# Altium project HIL_project.PrjPcb
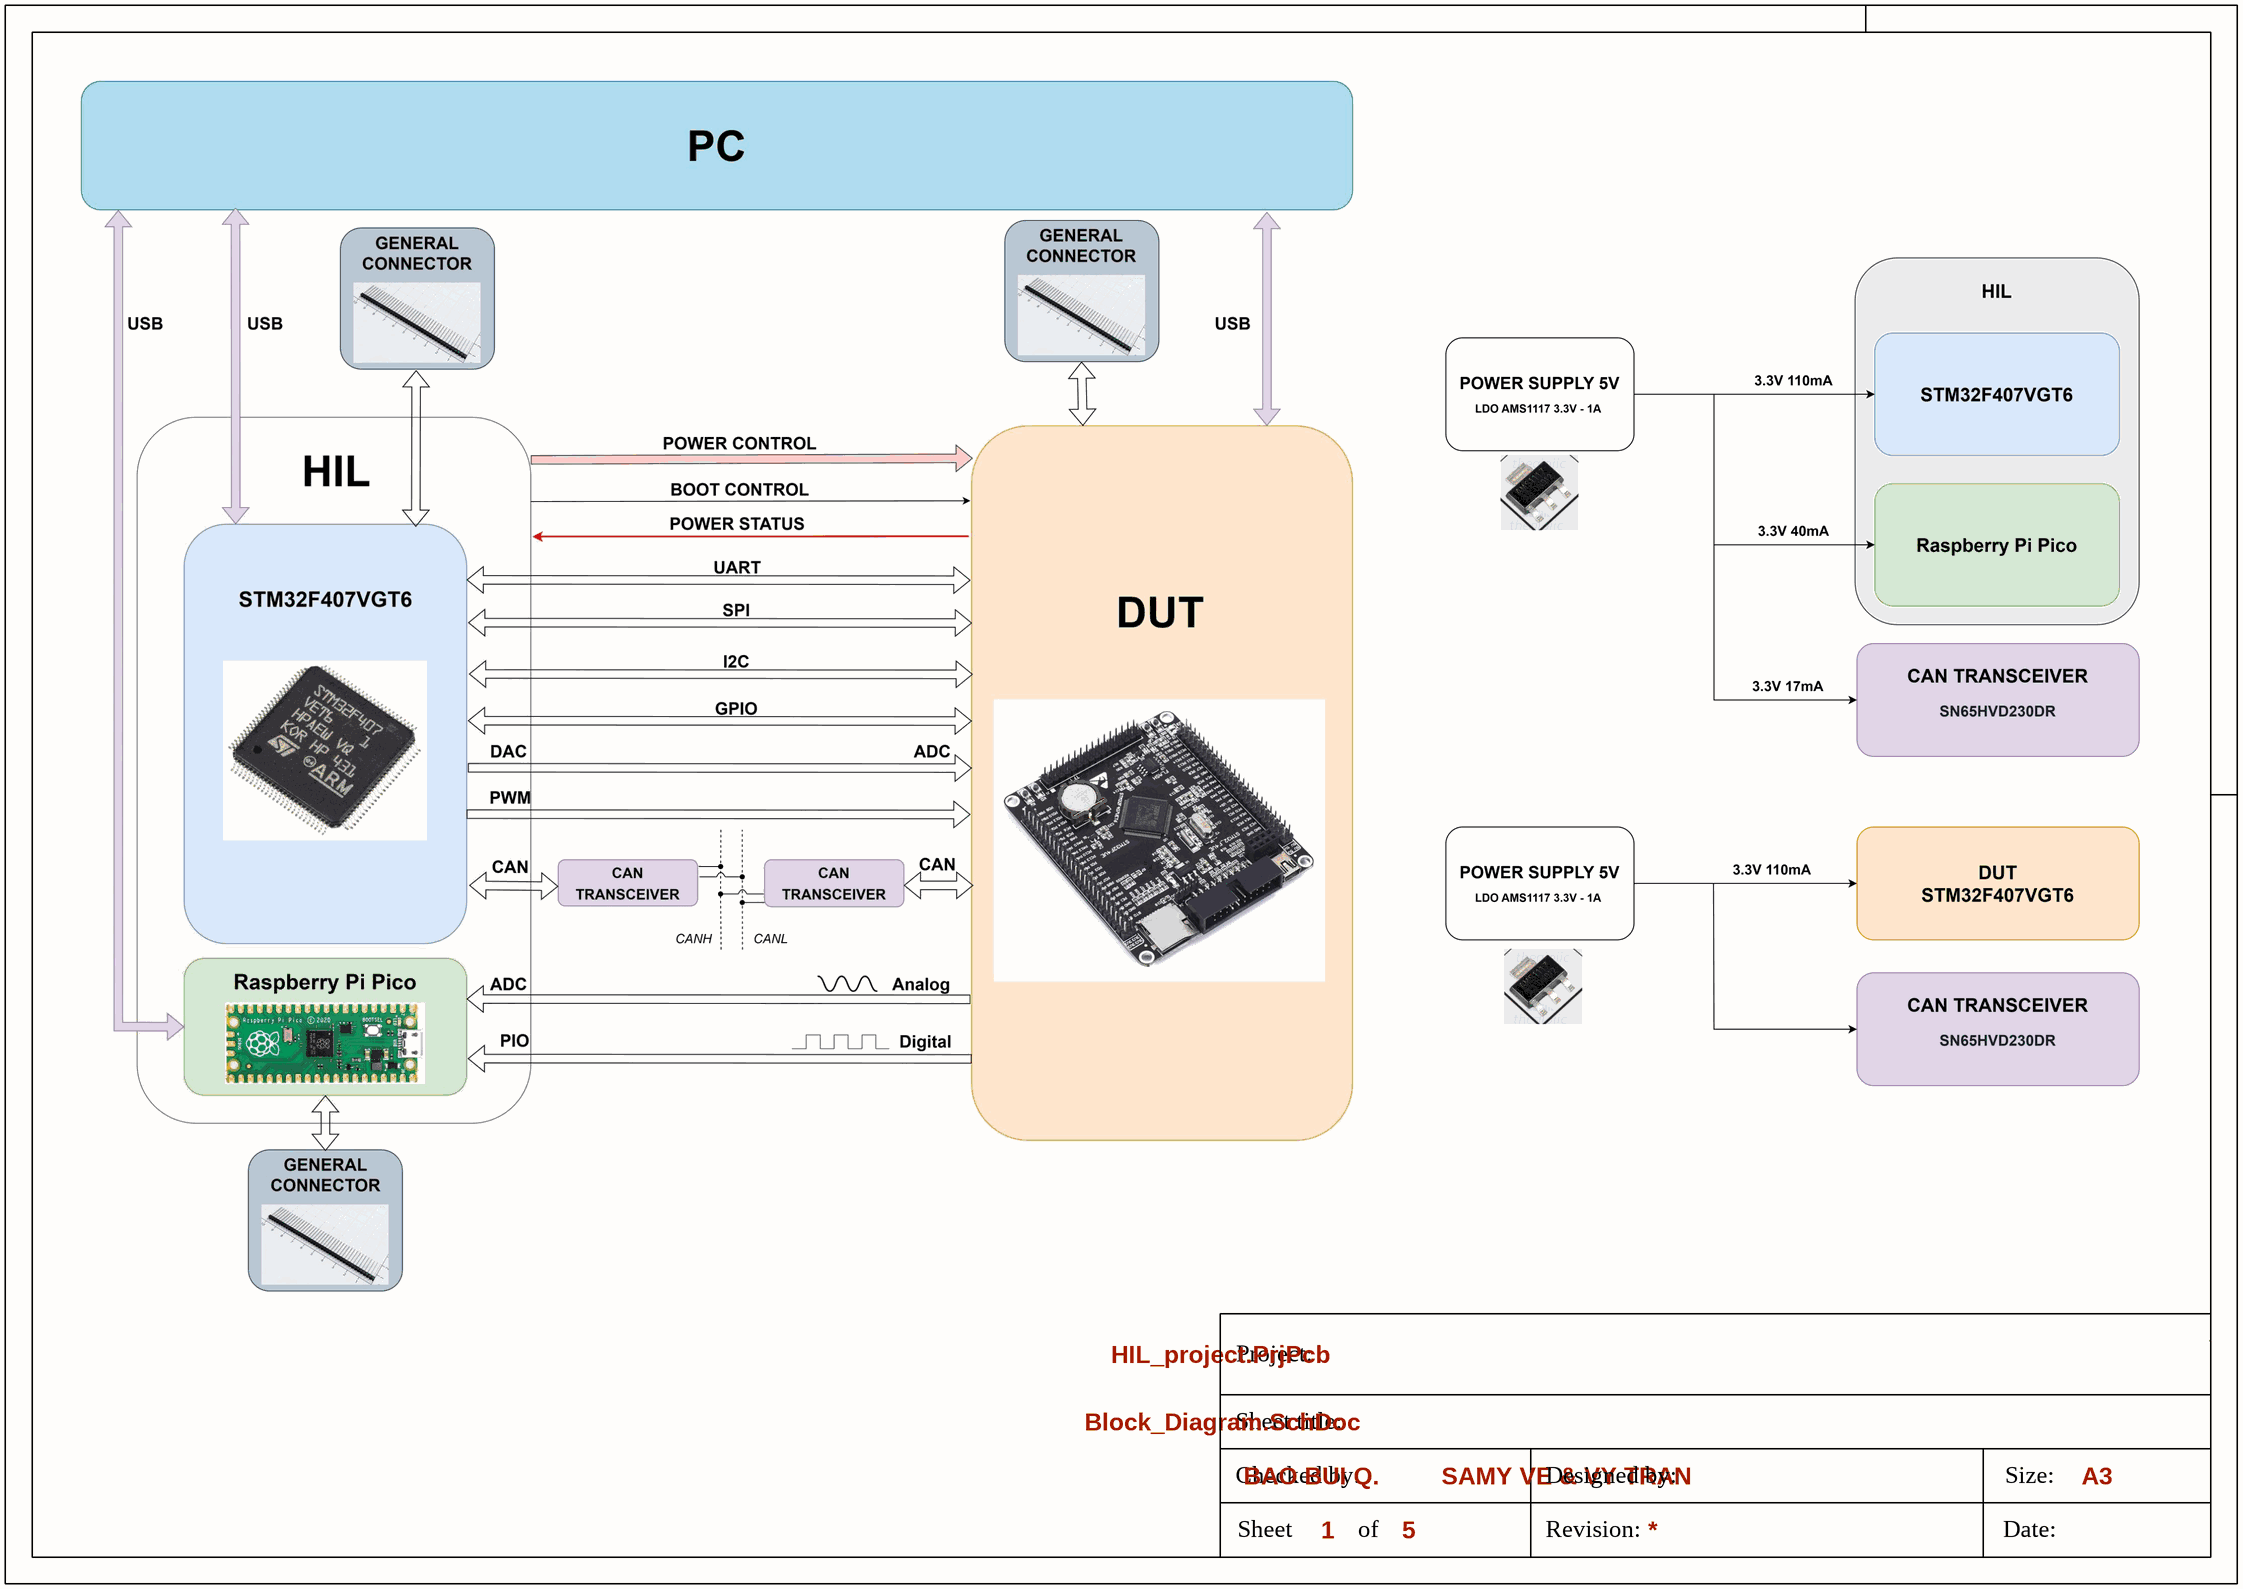
[diagram p0: Block_Diagram.SchDoc]
5 sheets, 116 parts. Net scope: global (net labels, ports and power ports of the same name join across sheets).
Board file: HIL_project.PcbDoc
Sheets:
  Block_Diagram.SchDoc
  HIL.SchDoc
  Power.SchDoc
  DUT.SchDoc
  HIL_Header.SchDoc

## Sheet Block_Diagram.SchDoc
size 420 x 297 mm; Designed_by: SAMY VE & VY TRAN; DrawnBy: SAMY VE & VY TRAN; SheetNumber: 1; SheetTotal: 5

### Notes on the sheet
- Project:
- Sheet title:
- BAO BUI Q.
- SAMY VE & VY TRAN
- A3
- Sheet
- Checked by:
- of
- Revision:
- Designed by:
- Size:
- Date:

## Sheet HIL.SchDoc
size 420 x 297 mm; DrawnBy: SAMY VE & VY TRAN; SheetNumber: 2; SheetTotal: 5
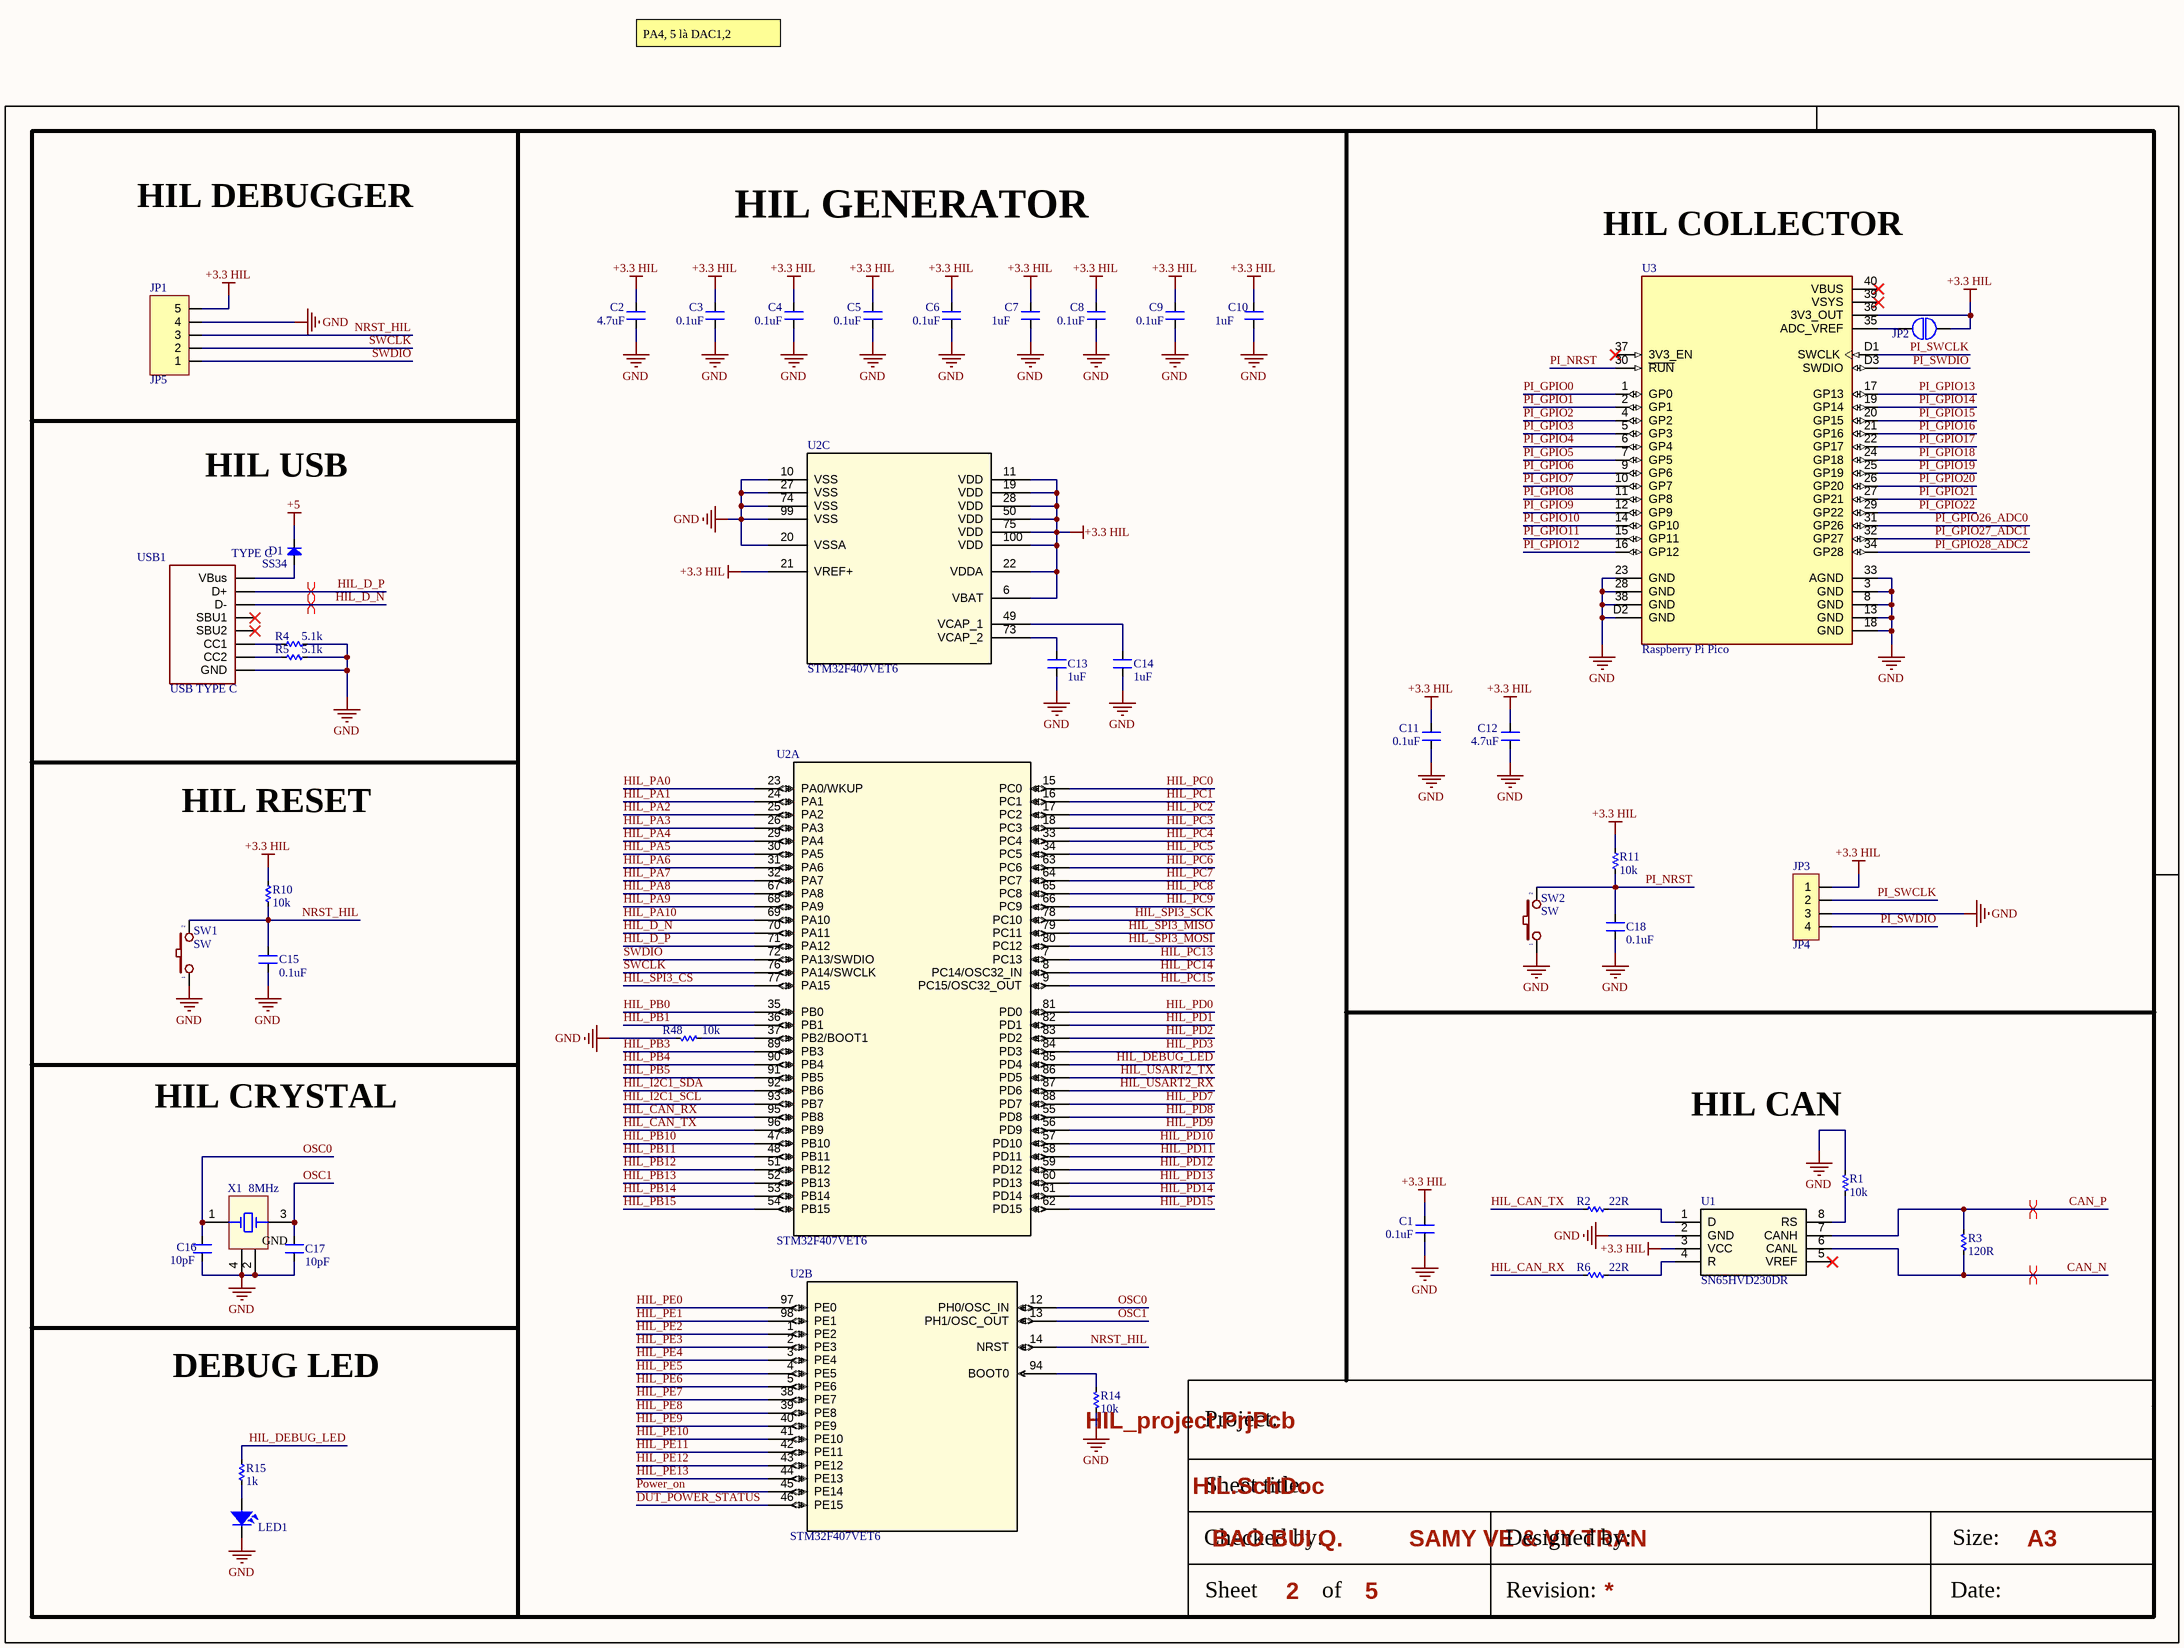
[diagram p1: HIL.SchDoc]

### Parts
C1  0.1uF  [CN-SMD-0603]
C2  4.7uF  [CN-SMD-0603]
C3  0.1uF  [CN-SMD-0603]
C4  0.1uF  [CN-SMD-0603]
C5  0.1uF  [CN-SMD-0603]
C6  0.1uF  [CN-SMD-0603]
C7  1uF  [CN-SMD-0603]
C8  0.1uF  [CN-SMD-0603]
C9  0.1uF  [CN-SMD-0603]
C10  1uF  [CN-SMD-0603]
C11  0.1uF  [CN-SMD-0603]
C12  4.7uF  [CN-SMD-0603]
C13  1uF  [CN-SMD-0603]
C14  1uF  [CN-SMD-0603]
C15  0.1uF  [CN-SMD-0603]
C16  10pF  [CN-SMD-0603]
C17  10pF  [CN-SMD-0603]
C18  0.1uF  [CN-SMD-0603]
D1  SS34  [DIO-SMD-A]
JP1  JP5  [JP5-D1C]
JP2  JUMP2  [Jump2]  (value not drawn)
JP3  JP4  [JP4-D1T]
LED1  LED  [LED-0805-Red]  (value not drawn)
R1  10k  [RES-SMD-0603]
R2  22R  [RES-SMD-0603]
R3  120R  [RES-SMD-0603]
R4  5.1k  [RES-SMD-0603]
R5  5.1k  [RES-SMD-0603]
R6  22R  [RES-SMD-0603]
R10  10k  [RES-SMD-0603]
R11  10k  [RES-SMD-0603]
R14  10k  [RES-SMD-0603]
R15  1k  [RES-SMD-0603]
R48  10k  [RES-SMD-0603]
SW1  SW  [SW1-SMD]
SW2  SW  [SW1-SMD]
U1  SN65HVD230DR  [SO8]
U2  STM32F407VET6  [LQFP100]  (parts A,B,C of 3)
U3  Raspberry Pi Pico  [Raspberry Pi Pico]
USB1  USB TYPE C  [TYPE C 16P]
X1  8MHz  [XT4-16.000MHz-4_V]

### Nets
+3.3 HIL: C1.1 C2.1 C3.1 C4.1 C5.1 C6.1 C7.1 C8.1 C9.1 C10.1 C11.1 C12.1 JP1.5 JP2.2 JP3.1 R10.1 R11.1 U1.3(VCC) U2.6(VBAT) U2.11(VDD) U2.19(VDD) U2.21(VREF+) U2.22(VDDA) U2.28(VDD) U2.50(VDD) U2.75(VDD) U2.100(VDD) U3.36(3V3_OUT)
+5: D1.2(K)
GND: C1.2 C2.2 C3.2 C4.2 C5.2 C6.2 C7.2 C8.2 C9.2 C10.2 C11.2 C12.2 C13.1 C14.1 C15.1 C16.1 C17.2 C18.1 JP1.4 JP3.3 LED1.2 R1.1 R4.2 R5.2 R14.2 R48.1 SW1.1 SW2.1 U1.2(GND) U2.10(VSS) U2.20(VSSA) U2.27(VSS) U2.74(VSS) U2.99(VSS) U3.3(GND) U3.8(GND) U3.13(GND) U3.18(GND) U3.23(GND) U3.28(GND) U3.33(AGND) U3.38(GND) U3.D2(GND) USB1.A1,A12,B1,B12,SHIELD(GND) X1.2(GND) X1.4(GND)
CAN_N: R3.2 U1.6(CANL)
CAN_P: R3.1 U1.7(CANH)
DUT_POWER_STATUS: U2.46(PE15)
HIL_CAN_RX: R6.2 U2.95(PB8)
HIL_CAN_TX: R2.2 U2.96(PB9)
HIL_D_N: U2.70(PA11) USB1.A7,B7(D-)
HIL_D_P: U2.71(PA12) USB1.A6,B6(D+)
HIL_DEBUG_LED: R15.2 U2.85(PD4)
HIL_I2C1_SCL: U2.93(PB7)
HIL_I2C1_SDA: U2.92(PB6)
HIL_PA0: U2.23(PA0/WKUP)
HIL_PA1: U2.24(PA1)
HIL_PA2: U2.25(PA2)
HIL_PA3: U2.26(PA3)
HIL_PA4: U2.29(PA4)
HIL_PA5: U2.30(PA5)
HIL_PA6: U2.31(PA6)
HIL_PA7: U2.32(PA7)
HIL_PA8: U2.67(PA8)
HIL_PA9: U2.68(PA9)
HIL_PA10: U2.69(PA10)
HIL_PB0: U2.35(PB0)
HIL_PB1: U2.36(PB1)
HIL_PB3: U2.89(PB3)
HIL_PB4: U2.90(PB4)
HIL_PB5: U2.91(PB5)
HIL_PB10: U2.47(PB10)
HIL_PB11: U2.48(PB11)
HIL_PB12: U2.51(PB12)
HIL_PB13: U2.52(PB13)
HIL_PB14: U2.53(PB14)
HIL_PB15: U2.54(PB15)
HIL_PC0: U2.15(PC0)
HIL_PC1: U2.16(PC1)
HIL_PC2: U2.17(PC2)
HIL_PC3: U2.18(PC3)
HIL_PC4: U2.33(PC4)
HIL_PC5: U2.34(PC5)
HIL_PC6: U2.63(PC6)
HIL_PC7: U2.64(PC7)
HIL_PC8: U2.65(PC8)
HIL_PC9: U2.66(PC9)
HIL_PC13: U2.7(PC13)
HIL_PC14: U2.8(PC14/OSC32_IN)
HIL_PC15: U2.9(PC15/OSC32_OUT)
HIL_PD0: U2.81(PD0)
HIL_PD1: U2.82(PD1)
HIL_PD2: U2.83(PD2)
HIL_PD3: U2.84(PD3)
HIL_PD7: U2.88(PD7)
HIL_PD8: U2.55(PD8)
HIL_PD9: U2.56(PD9)
HIL_PD10: U2.57(PD10)
HIL_PD11: U2.58(PD11)
HIL_PD12: U2.59(PD12)
HIL_PD13: U2.60(PD13)
HIL_PD14: U2.61(PD14)
HIL_PD15: U2.62(PD15)
HIL_PE0: U2.97(PE0)
HIL_PE1: U2.98(PE1)
HIL_PE2: U2.1(PE2)
HIL_PE3: U2.2(PE3)
HIL_PE4: U2.3(PE4)
HIL_PE5: U2.4(PE5)
HIL_PE6: U2.5(PE6)
HIL_PE7: U2.38(PE7)
HIL_PE8: U2.39(PE8)
HIL_PE9: U2.40(PE9)
HIL_PE10: U2.41(PE10)
HIL_PE11: U2.42(PE11)
HIL_PE12: U2.43(PE12)
HIL_PE13: U2.44(PE13)
HIL_SPI3_CS: U2.77(PA15)
HIL_SPI3_MISO: U2.79(PC11)
HIL_SPI3_MOSI: U2.80(PC12)
HIL_SPI3_SCK: U2.78(PC10)
HIL_USART2_RX: U2.87(PD6)
HIL_USART2_TX: U2.86(PD5)
NRST_HIL: C15.2 JP1.3 R10.2 SW1.2 U2.14(NRST)
OSC0: C16.2 U2.12(PH0/OSC_IN) X1.1(XTAL)
OSC1: C17.1 U2.13(PH1/OSC_OUT) X1.3(XTAL)
PI_GPIO0: U3.1(GP0)
PI_GPIO1: U3.2(GP1)
PI_GPIO2: U3.4(GP2)
PI_GPIO3: U3.5(GP3)
PI_GPIO4: U3.6(GP4)
PI_GPIO5: U3.7(GP5)
PI_GPIO6: U3.9(GP6)
PI_GPIO7: U3.10(GP7)
PI_GPIO8: U3.11(GP8)
PI_GPIO9: U3.12(GP9)
PI_GPIO10: U3.14(GP10)
PI_GPIO11: U3.15(GP11)
PI_GPIO12: U3.16(GP12)
PI_GPIO13: U3.17(GP13)
PI_GPIO14: U3.19(GP14)
PI_GPIO15: U3.20(GP15)
PI_GPIO16: U3.21(GP16)
PI_GPIO17: U3.22(GP17)
PI_GPIO18: U3.24(GP18)
PI_GPIO19: U3.25(GP19)
PI_GPIO20: U3.26(GP20)
PI_GPIO21: U3.27(GP21)
PI_GPIO22: U3.29(GP22)
PI_GPIO26_ADC0: U3.31(GP26)
PI_GPIO27_ADC1: U3.32(GP27)
PI_GPIO28_ADC2: U3.34(GP28)
PI_NRST: C18.2 R11.2 SW2.2 U3.30(~{RUN})
PI_SWCLK: JP3.2 U3.D1(SWCLK)
PI_SWDIO: JP3.4 U3.D3(SWDIO)
Power_on: U2.45(PE14)
SWCLK: JP1.2 U2.76(PA14/SWCLK)
SWDIO: JP1.1 U2.72(PA13/SWDIO)
NetC13_2: C13.2 U2.73(VCAP_2)
NetC14_2: C14.2 U2.49(VCAP_1)
NetD1_1: D1.1(A) USB1.A4,A9,B4,B9(VBus)
NetJP2_1: JP2.1 U3.35(ADC_VREF)
NetLED1_1: LED1.1 R15.1
NetR1_2: R1.2 U1.8(RS)
NetR2_1: R2.1 U1.1(D)
NetR4_1: R4.1 USB1.A5(CC1)
NetR5_1: R5.1 USB1.B5(CC2)
NetR6_1: R6.1 U1.4(R)
NetR14_1: R14.1 U2.94(BOOT0)
NetR48_2: R48.2 U2.37(PB2/BOOT1)

Not connected (* = marked no-connect by the designer): U1 5(VREF)*; U3 37(3V3_EN)* 39(VSYS)* 40(VBUS)*; USB1 A8(SBU1)* B8(SBU2)*

### Layout directives
differential pair: CAN_N, CAN_P, HIL_D_N, HIL_D_P

### Notes on the sheet
- PA4, 5 là DAC1,2
- HIL DEBUGGER
- HIL GENERATOR
- (near U3) HIL COLLECTOR
- HIL USB
- HIL RESET
- HIL CRYSTAL
- HIL CAN
- DEBUG LED
- Project:
- Sheet title:
- BAO BUI Q.
- SAMY VE & VY TRAN
- A3
- Sheet
- Checked by:
- of
- Revision:
- Designed by:
- Size:
- Date:
- (in symbol USB TYPE C) TYPE C

### Library data of the parts
C1-C18 = CN: Value: 33pF
D1 = Diode SMD: Default Diode; Code - JEDEC: DO-214-AB; Value: 1N5007; Published: 8-Jun-2000; Revision: July-2002: Re-released for DXP Platform.; Publisher: Altium Limited
JP1 = JP5: WR-PHD 2.54 mm Angled Socket Header; Manufacturer: W¨¹rth Elektronik eiSos GmbH; partNo: 613005143121; ComponentLink1 Description: Manufacturer; ComponentLink2 Description: Datasheet; NoPins: 05; Created Date: 29 March 2013; ComponentLink1URL: http://www.we-online.com; ComponentLink2URL: http://katalog.we-online.de/em/datasheet/6130xx143121.pdf; Created by: Karrer Zheng
JP3 = JP4: WR-PHD 2.54 mm Angled Socket Header; Manufacturer: W¨¹rth Elektronik eiSos GmbH; partNo: 613004143121; ComponentLink1 Description: Manufacturer; ComponentLink2 Description: Datasheet; NoPins: 04; Created Date: 29 March 2013; ComponentLink1URL: http://www.we-online.com; ComponentLink2URL: http://katalog.we-online.de/em/datasheet/6130xx143121.pdf; Created by: Karrer Zheng
LED1 = LED SMD: Value: LED 3 - 5 ly 2 Colour
R1-R6 R10 R11 R14 R15 R48 = Res-SMD: Resistor; Manufacturer: Generic Components; Class: Passive; Published: 08/06/2000; Publisher: Altium Hobart Technology Centre
SW1 SW2 = SW2: Switch button 2 pin; Value: SW chip 2 pin
U1 = SN65HVD251DR: IC TRANSCEIVER HALF 1/1 8SOIC
U2 = STM32F407VET6: High-performance foundation line, ARM Cortex-M4 core with DSP and FPU, 1 Mbyte Flash, 168 MHz CPU, ART Accelerator; Mfr_Name: STMicroelectronics; RefDes: RefDes; Type: Type
X1 = XT4: Crystal, 16 MHz, -30 to 85 degC, 3.2 x 2.5 x 0.9 mm SMD; Value: 4Mhz

## Sheet Power.SchDoc
size 420 x 297 mm; SheetNumber: 3; SheetTotal: 5
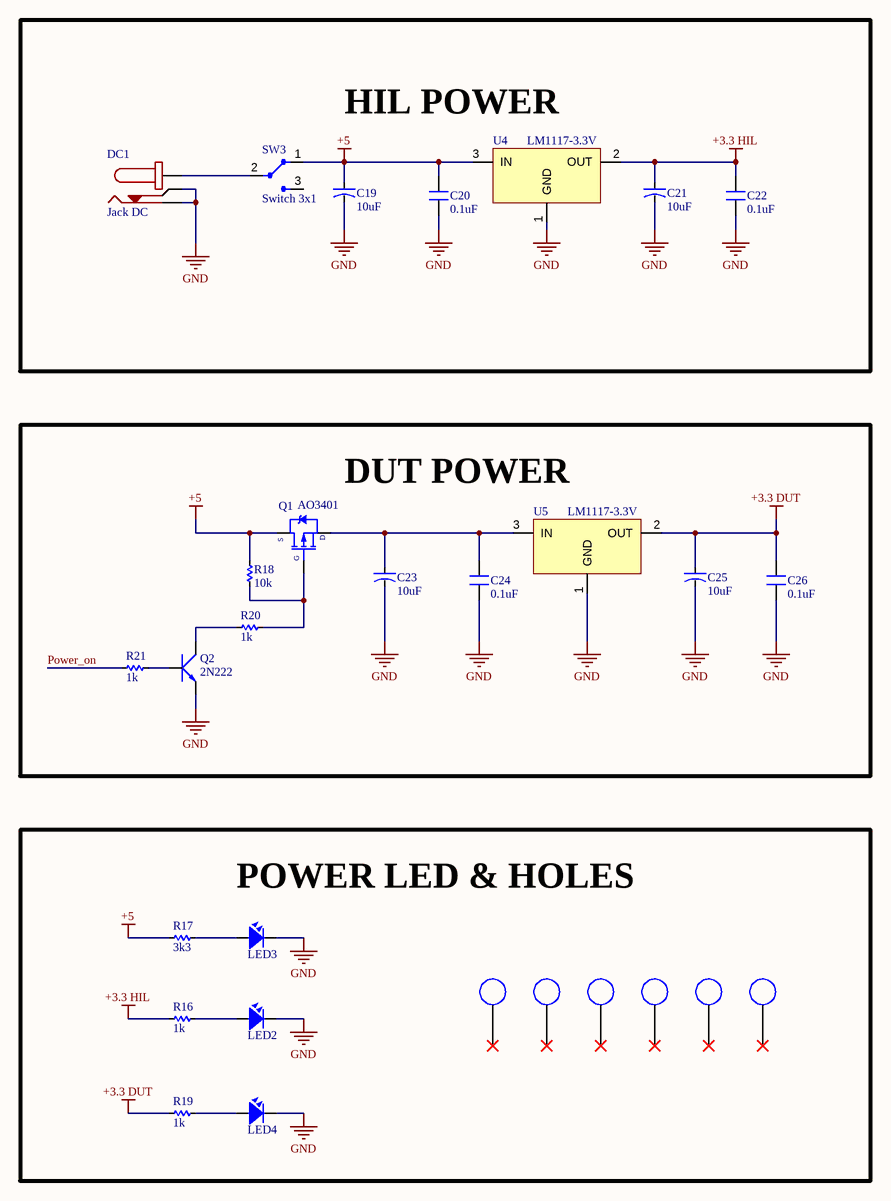
[diagram p2: Power.SchDoc]

### Parts
C19  10uF  [CAP-ALU-SMD-4.5x5x1.4]
C20  0.1uF  [CN-SMD-0603]
C21  10uF  [CAP-ALU-SMD-4.5x5x1.4]
C22  0.1uF  [CN-SMD-0603]
C23  10uF  [CAP-ALU-SMD-4.5x5x1.4]
C24  0.1uF  [CN-SMD-0603]
C25  10uF  [CAP-ALU-SMD-4.5x5x1.4]
C26  0.1uF  [CN-SMD-0603]
DC1  Jack DC  [DC0]
H1  M3  [M3]  (value not drawn)
H2  M3  [M3]  (value not drawn)
H3  M3  [M3]  (value not drawn)
H4  M3  [M3]  (value not drawn)
H5  M3  [M3]  (value not drawn)
H6  M3  [M3]  (value not drawn)
LED2  LED  [LED-0805-Red]  (value not drawn)
LED3  LED  [LED-0805-Red]  (value not drawn)
LED4  LED  [LED-0805-Red]  (value not drawn)
Q1  AO3401  [SOT23-123]
Q2  2N222  [SOT23-231]
R16  1k  [RES-SMD-0603]
R17  3k3  [RES-SMD-0603]
R18  10k  [RES-SMD-0603]
R19  1k  [RES-SMD-0603]
R20  1k  [RES-SMD-0603]
R21  1k  [RES-SMD-0603]
SW3  Switch 3x1  [SS12D00]
U4  LM1117-3.3V  [SOT223]
U5  LM1117-3.3V  [SOT223]

### Blocks framed on the sheet
HIL POWER: C19-C22 DC1 SW3 U4
DUT POWER: C23-C26 Q1 Q2 R18 R20 R21 U5
POWER LED & HOLES: H1-H6 LED2-LED4 R16 R17 R19

### Nets
+3.3 DUT: C25.1 C26.2 R19.1 U5.2(OUT)
+3.3 HIL: C21.1 C22.2 R16.1 U4.2(OUT)
+5: C19.1 C20.2 Q1.3(S) R17.1 R18.2 SW3.1 U4.3(IN)
GND: C19.2 C20.1 C21.2 C22.1 C23.2 C24.1 C25.2 C26.1 DC1.2(TN) DC1.3(T) LED2.2 LED3.2 LED4.2 Q2.1(E) U4.1(GND) U5.1(GND)
Power_on: R21.2
NetC23_1: C23.1 C24.2 Q1.2(D) U5.3(IN)
NetDC1_1: DC1.1(S) SW3.2
NetLED2_1: LED2.1 R16.2
NetLED3_1: LED3.1 R17.2
NetLED4_1: LED4.1 R19.2
NetQ1_1: Q1.1(G) R18.1 R20.1
NetQ2_2: Q2.2(B) R21.1
NetQ2_3: Q2.3(C) R20.2

Not connected (* = marked no-connect by the designer): H1 1(76)*; H2 1(76)*; H3 1(76)*; H4 1(76)*; H5 1(76)*; H6 1(76)*; SW3 3(I/O2)

### Notes on the sheet
- Project:
- Sheet title:
- BAO BUI Q.
- SAMY VE & VY TRAN
- A3
- Sheet
- Checked by:
- of
- Revision:
- Designed by:
- Size:
- Date:

### Library data of the parts
C19 C21 C23 C25 = CN-ALU-DIP: Capacitor (Semiconductor SIM Model); Value: 104; LatestRevisionDate: 17-Jul-2002; LatestRevisionNote: Re-released for DXP Platform.; PackageReference: C1206; Publisher: Altium Limited
C20 C22 C24 C26 = CN: Value: 33pF
DC1 = DCIN: Jack DC input; Value: Jac DC
LED2-LED4 = LED SMD: Value: LED 3 - 5 ly 2 Colour
Q1 = AO3401: P-MOS 30V 4A
Q2 = 2N222: NPN 600mW, ECB; Value: C1815
R16-R21 = Res-SMD: as R1 on sheet HIL; Published: 08/06/2000; Publisher: Altium Hobart Technology Centre
SW3 = SW3x1: Value: Switch 4x2
U4 U5 = LM1117: 800mA Low-Dropout Linear Regulator; Creator: Nguyen Ba Bien; Website: http://group3i.net

## Sheet DUT.SchDoc
size 420 x 297 mm; SheetNumber: 4; SheetTotal: 5
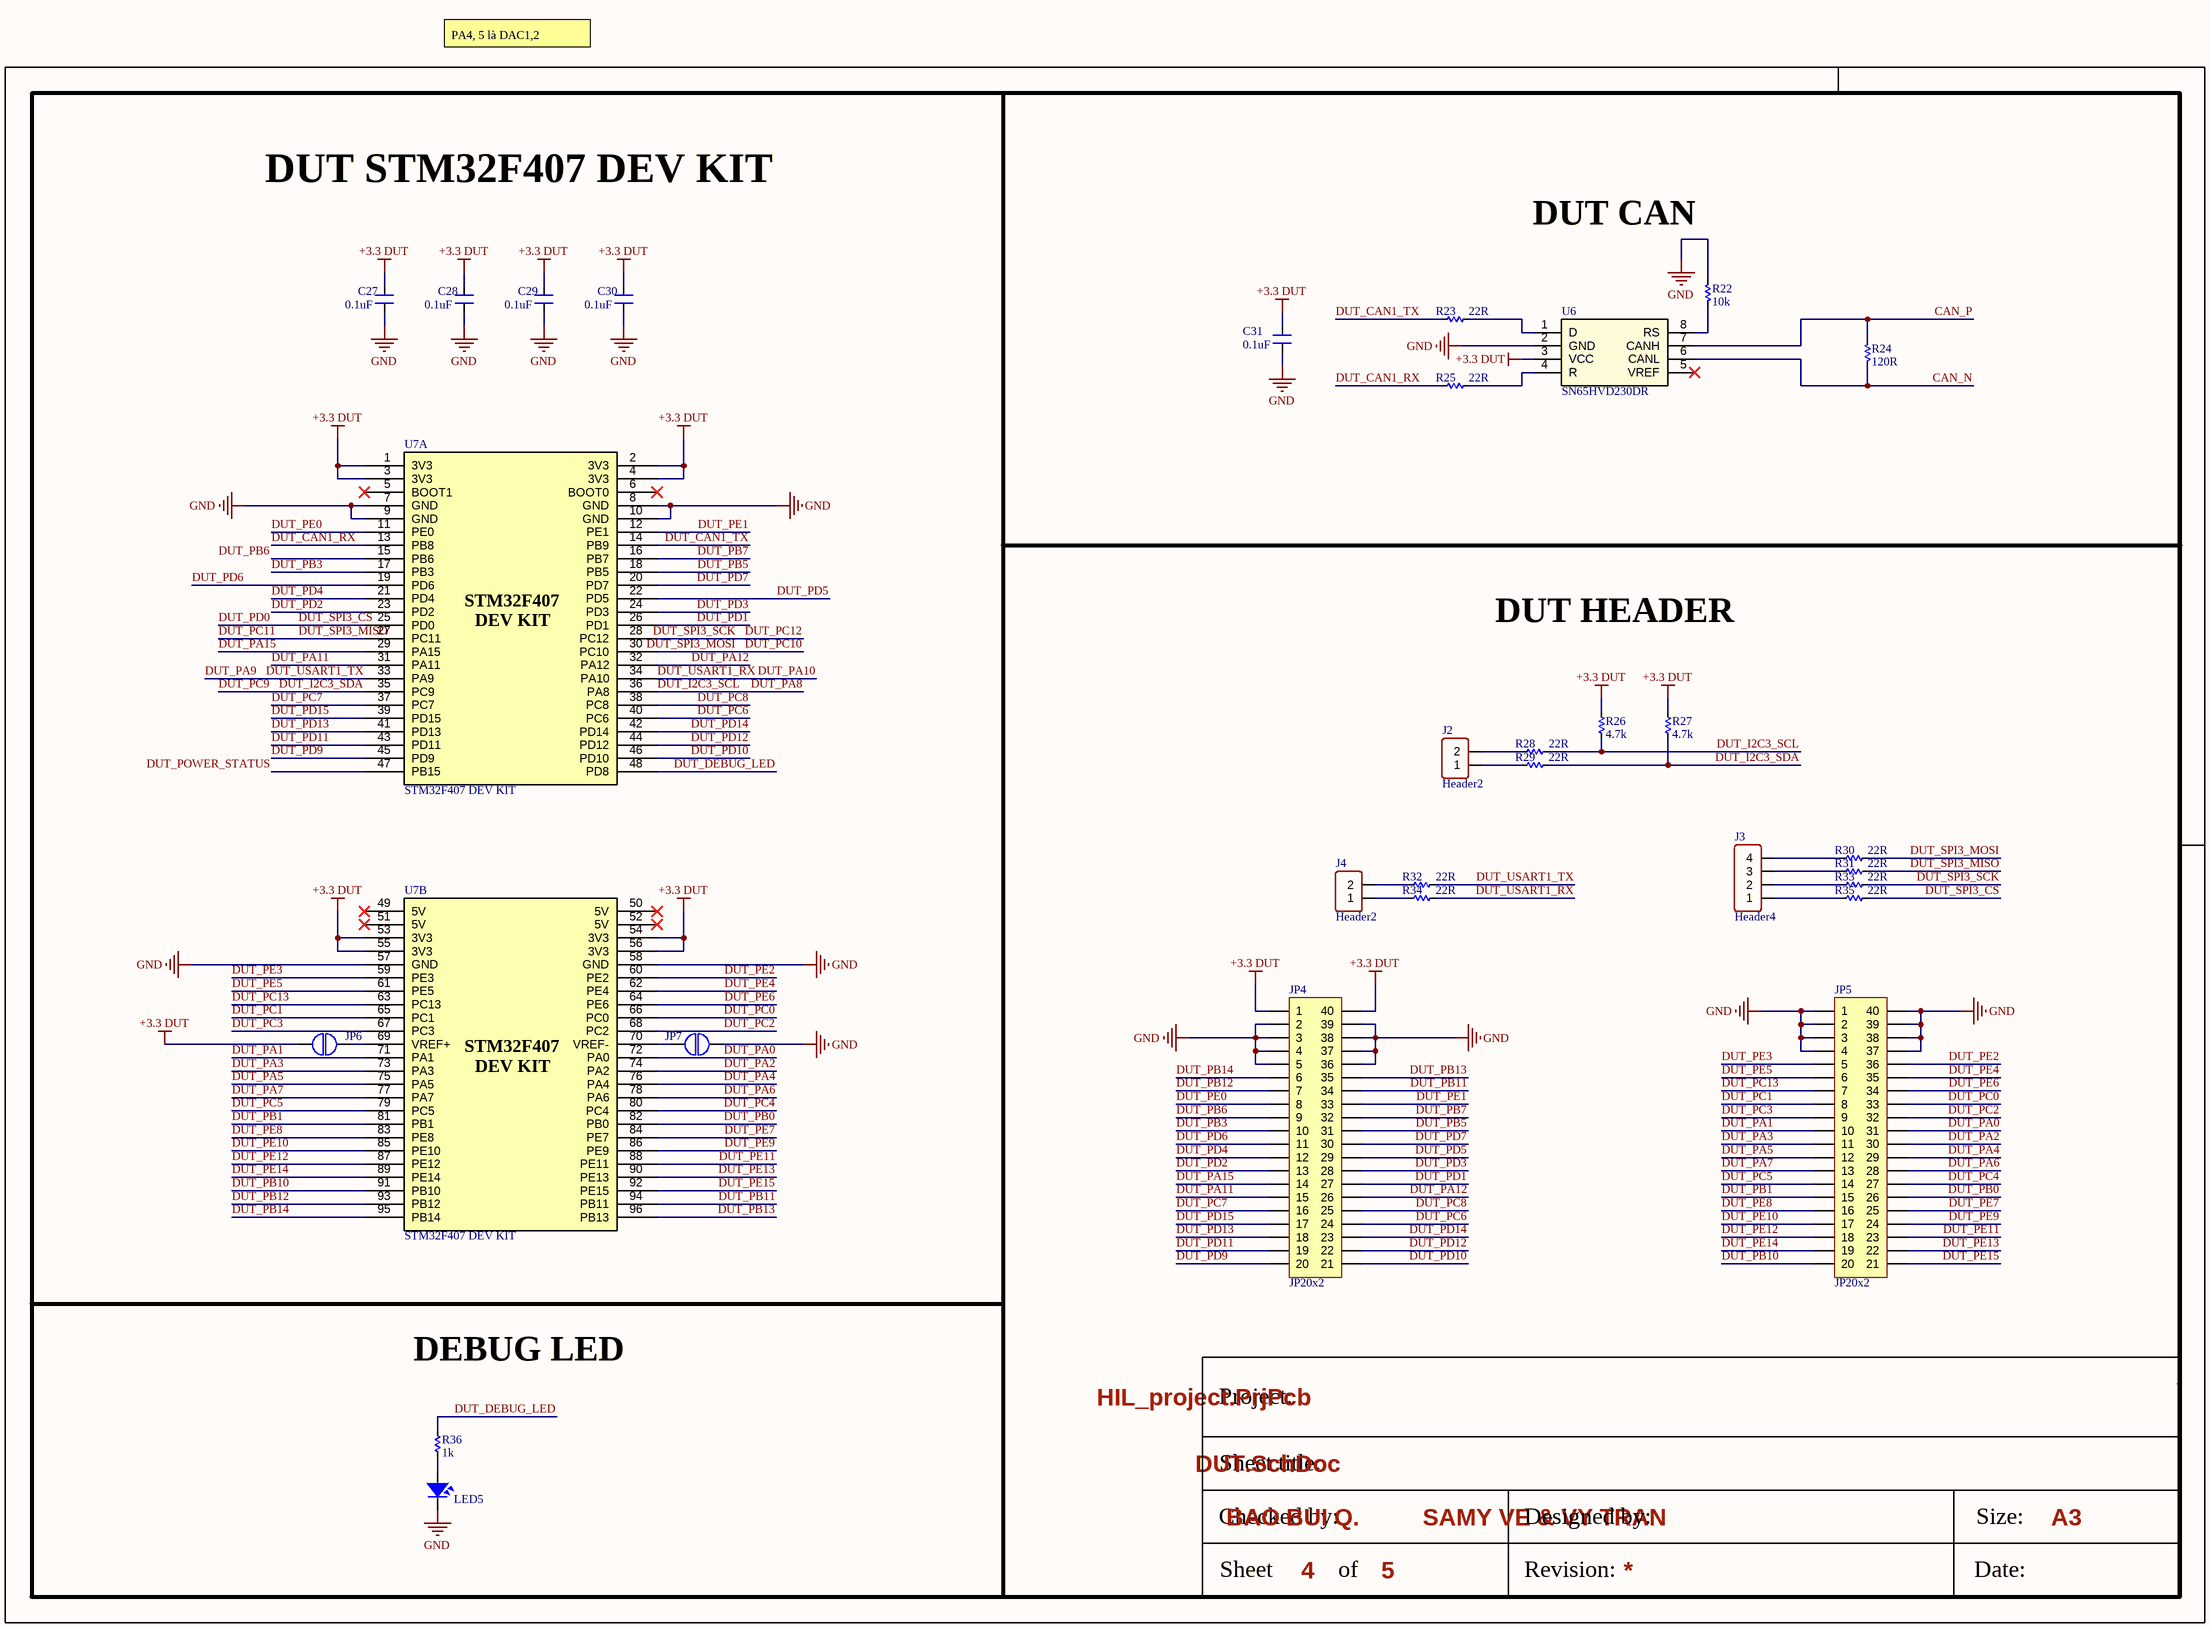
[diagram p3: DUT.SchDoc]

### Parts
C27  0.1uF  [CN-SMD-0603]
C28  0.1uF  [CN-SMD-0603]
C29  0.1uF  [CN-SMD-0603]
C30  0.1uF  [CN-SMD-0603]
C31  0.1uF  [CN-SMD-0603]
J2  Header2  [XH2.54-2-DIP]
J3  Header4  [XH2.54-4-DIP]
J4  Header2  [XH2.54-2-DIP]
JP4  JP20x2  [JP20-D2T]
JP5  JP20x2  [JP20-D2T]
JP6  JUMP2  [Jump2]  (value not drawn)
JP7  JUMP2  [Jump2]  (value not drawn)
LED5  LED  [LED-0805-Red]  (value not drawn)
R22  10k  [RES-SMD-0603]
R23  22R  [RES-SMD-0603]
R24  120R  [RES-SMD-0603]
R25  22R  [RES-SMD-0603]
R26  4.7k  [RES-SMD-0603]
R27  4.7k  [RES-SMD-0603]
R28  22R  [RES-SMD-0603]
R29  22R  [RES-SMD-0603]
R30  22R  [RES-SMD-0603]
R31  22R  [RES-SMD-0603]
R32  22R  [RES-SMD-0603]
R33  22R  [RES-SMD-0603]
R34  22R  [RES-SMD-0603]
R35  22R  [RES-SMD-0603]
R36  1k  [RES-SMD-0603]
U6  SN65HVD230DR  [SO8]
U7  STM32F407 DEV KIT  [STM32F407 DEV KIT]  (parts A,B of 2)

### Nets
+3.3 DUT: C27.1 C28.1 C29.1 C30.1 C31.1 JP4.1 JP4.40 JP6.1 R26.1 R27.1 U6.3(VCC) U7.1(3V3) U7.2(3V3) U7.3(3V3) U7.4(3V3) U7.53(3V3) U7.54(3V3) U7.55(3V3) U7.56(3V3)
GND: C27.2 C28.2 C29.2 C30.2 C31.2 JP4.2 JP4.3 JP4.4 JP4.5 JP4.36 JP4.37 JP4.38 JP4.39 JP5.1 JP5.2 JP5.3 JP5.4 JP5.37 JP5.38 JP5.39 JP5.40 JP7.2 LED5.2 R22.1 U6.2(GND) U7.7(GND) U7.8(GND) U7.9(GND) U7.10(GND) U7.57(GND) U7.58(GND)
CAN_N: R24.2 U6.6(CANL)
CAN_P: R24.1 U6.7(CANH)
DUT_CAN1_RX: R25.2 U7.13(PB8)
DUT_CAN1_TX: R23.2 U7.14(PB9)
DUT_DEBUG_LED: R36.2 U7.48(PD8)
DUT_I2C3_SCL: R26.2 R28.1 U7.36(PA8)  [also labelled DUT_PA8]
DUT_I2C3_SDA: R27.2 R29.1 U7.35(PC9)  [also labelled DUT_PC9]
DUT_PA0: JP5.31 U7.72(PA0)
DUT_PA1: JP5.10 U7.71(PA1)
DUT_PA2: JP5.30 U7.74(PA2)
DUT_PA3: JP5.11 U7.73(PA3)
DUT_PA4: JP5.29 U7.76(PA4)
DUT_PA5: JP5.12 U7.75(PA5)
DUT_PA6: JP5.28 U7.78(PA6)
DUT_PA7: JP5.13 U7.77(PA7)
DUT_PA9: R32.1 U7.33(PA9)  [also labelled DUT_USART1_TX]
DUT_PA10: R34.1 U7.34(PA10)  [also labelled DUT_USART1_RX]
DUT_PA11: JP4.15 U7.31(PA11)
DUT_PA12: JP4.26 U7.32(PA12)
DUT_PA15: JP4.14 U7.29(PA15)
DUT_PB0: JP5.26 U7.82(PB0)
DUT_PB1: JP5.15 U7.81(PB1)
DUT_PB3: JP4.10 U7.17(PB3)
DUT_PB5: JP4.31 U7.18(PB5)
DUT_PB6: JP4.9 U7.15(PB6)
DUT_PB7: JP4.32 U7.16(PB7)
DUT_PB10: JP5.20 U7.91(PB10)
DUT_PB11: JP4.34 U7.94(PB11)
DUT_PB12: JP4.7 U7.93(PB12)
DUT_PB13: JP4.35 U7.96(PB13)
DUT_PB14: JP4.6 U7.95(PB14)
DUT_PC0: JP5.33 U7.66(PC0)
DUT_PC1: JP5.8 U7.65(PC1)
DUT_PC2: JP5.32 U7.68(PC2)
DUT_PC3: JP5.9 U7.67(PC3)
DUT_PC4: JP5.27 U7.80(PC4)
DUT_PC5: JP5.14 U7.79(PC5)
DUT_PC6: JP4.24 U7.40(PC6)
DUT_PC7: JP4.16 U7.37(PC7)
DUT_PC8: JP4.25 U7.38(PC8)
DUT_PC10: R30.1 U7.30(PC10)  [also labelled DUT_SPI3_MOSI]
DUT_PC11: R31.1 U7.27(PC11)  [also labelled DUT_SPI3_MISO]
DUT_PC12: R33.1 U7.28(PC12)  [also labelled DUT_SPI3_SCK]
DUT_PC13: JP5.7 U7.63(PC13)
DUT_PD0: R35.1 U7.25(PD0)  [also labelled DUT_SPI3_CS]
DUT_PD1: JP4.27 U7.26(PD1)
DUT_PD2: JP4.13 U7.23(PD2)
DUT_PD3: JP4.28 U7.24(PD3)
DUT_PD4: JP4.12 U7.21(PD4)
DUT_PD5: JP4.29 U7.22(PD5)
DUT_PD6: JP4.11 U7.19(PD6)
DUT_PD7: JP4.30 U7.20(PD7)
DUT_PD9: JP4.20 U7.45(PD9)
DUT_PD10: JP4.21 U7.46(PD10)
DUT_PD11: JP4.19 U7.43(PD11)
DUT_PD12: JP4.22 U7.44(PD12)
DUT_PD13: JP4.18 U7.41(PD13)
DUT_PD14: JP4.23 U7.42(PD14)
DUT_PD15: JP4.17 U7.39(PD15)
DUT_PE0: JP4.8 U7.11(PE0)
DUT_PE1: JP4.33 U7.12(PE1)
DUT_PE2: JP5.36 U7.60(PE2)
DUT_PE3: JP5.5 U7.59(PE3)
DUT_PE4: JP5.35 U7.62(PE4)
DUT_PE5: JP5.6 U7.61(PE5)
DUT_PE6: JP5.34 U7.64(PE6)
DUT_PE7: JP5.25 U7.84(PE7)
DUT_PE8: JP5.16 U7.83(PE8)
DUT_PE9: JP5.24 U7.86(PE9)
DUT_PE10: JP5.17 U7.85(PE10)
DUT_PE11: JP5.23 U7.88(PE11)
DUT_PE12: JP5.18 U7.87(PE12)
DUT_PE13: JP5.22 U7.90(PE13)
DUT_PE14: JP5.19 U7.89(PE14)
DUT_PE15: JP5.21 U7.92(PE15)
DUT_POWER_STATUS: U7.47(PB15)
NetJ2_1: J2.1 R29.2
NetJ2_2: J2.2 R28.2
NetJ3_1: J3.1 R35.2
NetJ3_2: J3.2 R33.2
NetJ3_3: J3.3 R31.2
NetJ3_4: J3.4 R30.2
NetJ4_1: J4.1 R34.2
NetJ4_2: J4.2 R32.2
NetJP6_2: JP6.2 U7.69(VREF+)
NetJP7_1: JP7.1 U7.70(VREF-)
NetLED5_1: LED5.1 R36.1
NetR22_2: R22.2 U6.8(RS)
NetR23_1: R23.1 U6.1(D)
NetR25_1: R25.1 U6.4(R)

Not connected (* = marked no-connect by the designer): U6 5(VREF)*; U7 5(BOOT1)* 6(BOOT0)* 49(5V)* 50(5V)* 51(5V)* 52(5V)*

### Notes on the sheet
- PA4, 5 là DAC1,2
- DUT STM32F407 DEV KIT
- DUT CAN
- DUT HEADER
- DEBUG LED
- Project:
- Sheet title:
- BAO BUI Q.
- SAMY VE & VY TRAN
- A3
- Sheet
- Checked by:
- of
- Revision:
- Designed by:
- Size:
- Date:
- (in symbol STM32F407 DEV KIT, part A) STM32F407; DEV KIT
- (in symbol STM32F407 DEV KIT, part B) STM32F407; DEV KIT

### Library data of the parts
C27-C31 = CN: Value: 33pF
J2 J4 = Header2: Connector 2; Manufacturer: W¨¹rth Elektronik eiSos GmbH; partNo: 613002143121; ComponentLink1 Description: Manufacturer; ComponentLink2 Description: Datasheet; NoPins: 02; Created Date: 29 March 2013; ComponentLink1URL: http://www.we-online.com; ComponentLink2URL: http://katalog.we-online.de/em/datasheet/6130xx143121.pdf; Created by: Karrer Zheng
J3 = Header4: Connector 4; Manufacturer: W¨¹rth Elektronik eiSos GmbH; partNo: 613002143121; ComponentLink1 Description: Manufacturer; ComponentLink2 Description: Datasheet; NoPins: 02; Created Date: 29 March 2013; ComponentLink1URL: http://www.we-online.com; ComponentLink2URL: http://katalog.we-online.de/em/datasheet/6130xx143121.pdf; Created by: Karrer Zheng
JP4 JP5 = JP20x2: WR-PHD 2.54 mm Dual Socket Header; Manufacturer: W¨¹rth Elektronik eiSos GmbH; partNo: 61304021821; ComponentLink1 Description: Manufacturer; ComponentLink2 Description: Datasheet; NoPins: 40; Created Date: 29 March 2013; ComponentLink1URL: http://www.we-online.com; ComponentLink2URL: http://katalog.we-online.de/em/datasheet/6130xx21821.pdf; Created by: Karrer Zheng
LED5 = LED SMD: Value: LED 3 - 5 ly 2 Colour
R22-R36 = Res-SMD: as R1 on sheet HIL; Published: 08/06/2000; Publisher: Altium Hobart Technology Centre
U6 = SN65HVD251DR: IC TRANSCEIVER HALF 1/1 8SOIC

## Sheet HIL_Header.SchDoc
size 420 x 297 mm; SheetNumber: 5; SheetTotal: 5
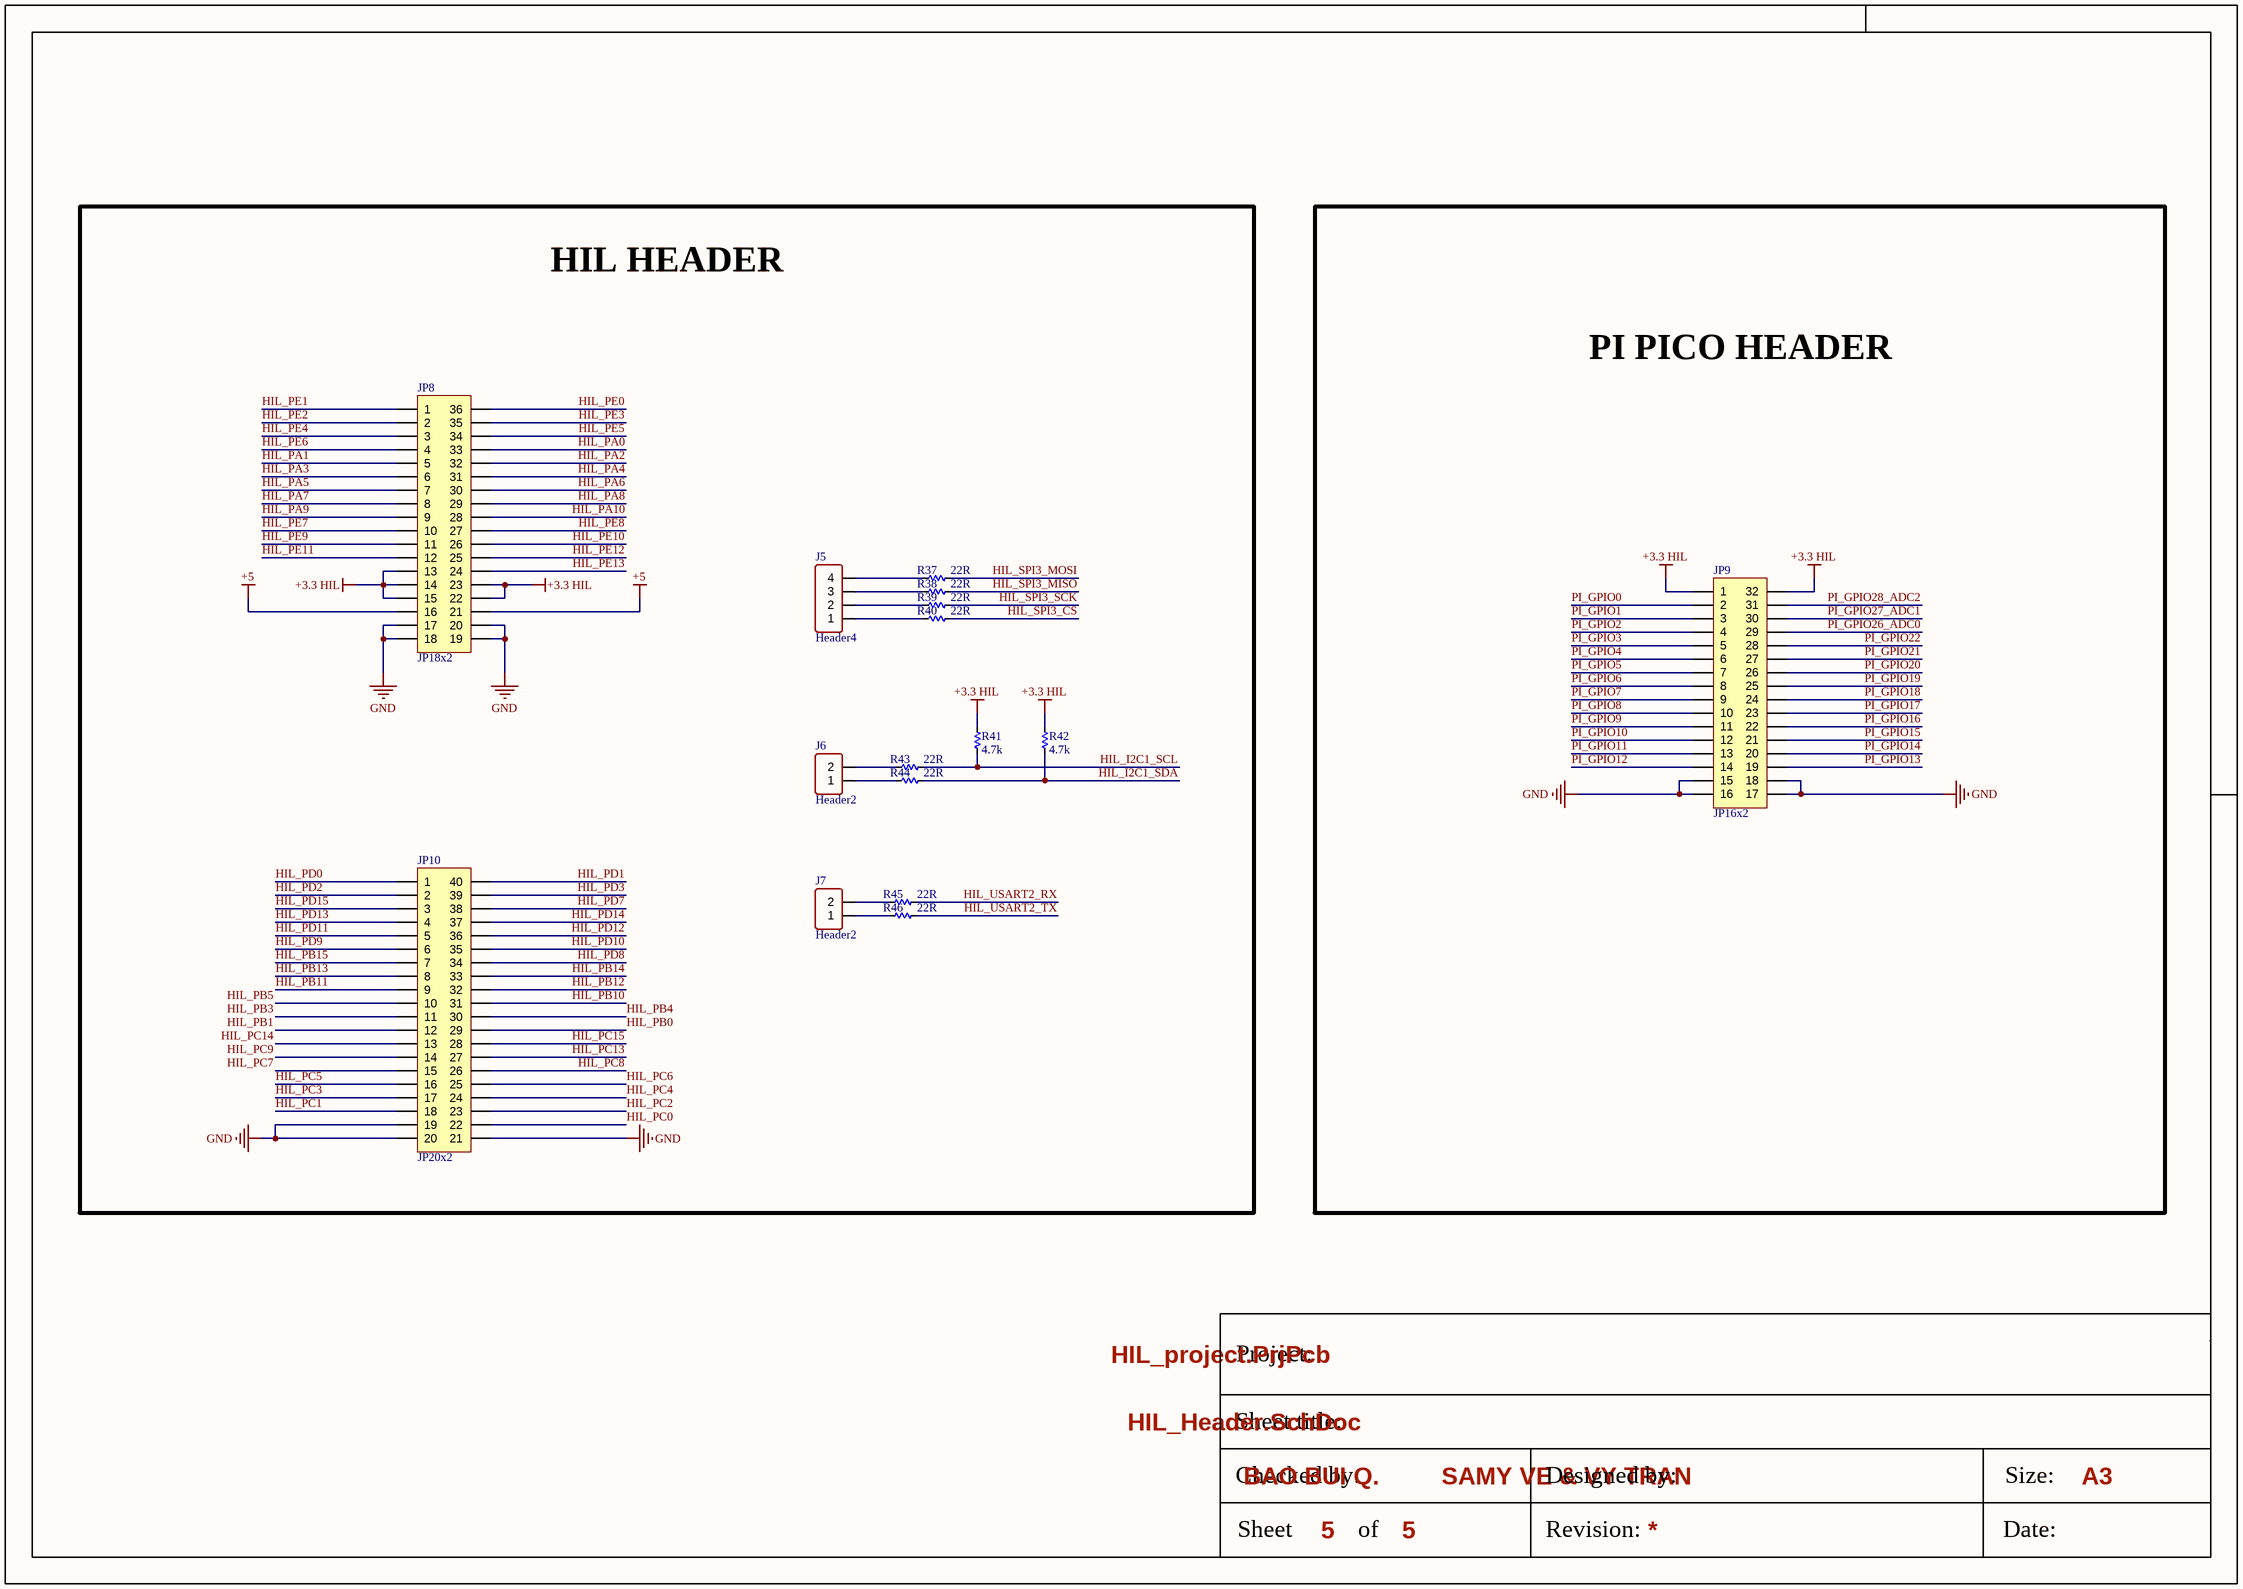
[diagram p4: HIL_Header.SchDoc]

### Parts
J5  Header4  [XH2.54-4-DIP]
J6  Header2  [XH2.54-2-DIP]
J7  Header2  [XH2.54-2-DIP]
JP8  JP18x2  [JP18-D2T]
JP9  JP16x2  [JP16-D2T]
JP10  JP20x2  [JP20-D2T]
R37  22R  [RES-SMD-0603]
R38  22R  [RES-SMD-0603]
R39  22R  [RES-SMD-0603]
R40  22R  [RES-SMD-0603]
R41  4.7k  [RES-SMD-0603]
R42  4.7k  [RES-SMD-0603]
R43  22R  [RES-SMD-0603]
R44  22R  [RES-SMD-0603]
R45  22R  [RES-SMD-0603]
R46  22R  [RES-SMD-0603]

### Blocks framed on the sheet
HIL HEADER: J5-J7 JP8 JP10 R37-R46
PI PICO HEADER: JP9

### Nets
+3.3 HIL: JP8.13 JP8.14 JP8.15 JP8.22 JP8.23 JP9.1 JP9.32 R41.1 R42.1
+5: JP8.16 JP8.21
GND: JP8.17 JP8.18 JP8.19 JP8.20 JP9.15 JP9.16 JP9.17 JP9.18 JP10.19 JP10.20 JP10.21
HIL_I2C1_SCL: R41.2 R43.1
HIL_I2C1_SDA: R42.2 R44.1
HIL_PA0: JP8.33
HIL_PA1: JP8.5
HIL_PA2: JP8.32
HIL_PA3: JP8.6
HIL_PA4: JP8.31
HIL_PA5: JP8.7
HIL_PA6: JP8.30
HIL_PA7: JP8.8
HIL_PA8: JP8.29
HIL_PA9: JP8.9
HIL_PA10: JP8.28
HIL_PB0: JP10.29
HIL_PB1: JP10.12
HIL_PB3: JP10.11
HIL_PB4: JP10.30
HIL_PB5: JP10.10
HIL_PB10: JP10.31
HIL_PB11: JP10.9
HIL_PB12: JP10.32
HIL_PB13: JP10.8
HIL_PB14: JP10.33
HIL_PB15: JP10.7
HIL_PC0: JP10.22
HIL_PC1: JP10.18
HIL_PC2: JP10.23
HIL_PC3: JP10.17
HIL_PC4: JP10.24
HIL_PC5: JP10.16
HIL_PC6: JP10.25
HIL_PC7: JP10.15
HIL_PC8: JP10.26
HIL_PC9: JP10.14
HIL_PC13: JP10.27
HIL_PC14: JP10.13
HIL_PC15: JP10.28
HIL_PD0: JP10.1
HIL_PD1: JP10.40
HIL_PD2: JP10.2
HIL_PD3: JP10.39
HIL_PD7: JP10.38
HIL_PD8: JP10.34
HIL_PD9: JP10.6
HIL_PD10: JP10.35
HIL_PD11: JP10.5
HIL_PD12: JP10.36
HIL_PD13: JP10.4
HIL_PD14: JP10.37
HIL_PD15: JP10.3
HIL_PE0: JP8.36
HIL_PE1: JP8.1
HIL_PE2: JP8.2
HIL_PE3: JP8.35
HIL_PE4: JP8.3
HIL_PE5: JP8.34
HIL_PE6: JP8.4
HIL_PE7: JP8.10
HIL_PE8: JP8.27
HIL_PE9: JP8.11
HIL_PE10: JP8.26
HIL_PE11: JP8.12
HIL_PE12: JP8.25
HIL_PE13: JP8.24
HIL_SPI3_CS: R40.1
HIL_SPI3_MISO: R38.1
HIL_SPI3_MOSI: R37.1
HIL_SPI3_SCK: R39.1
HIL_USART2_RX: R45.1
HIL_USART2_TX: R46.1
PI_GPIO0: JP9.2
PI_GPIO1: JP9.3
PI_GPIO2: JP9.4
PI_GPIO3: JP9.5
PI_GPIO4: JP9.6
PI_GPIO5: JP9.7
PI_GPIO6: JP9.8
PI_GPIO7: JP9.9
PI_GPIO8: JP9.10
PI_GPIO9: JP9.11
PI_GPIO10: JP9.12
PI_GPIO11: JP9.13
PI_GPIO12: JP9.14
PI_GPIO13: JP9.19
PI_GPIO14: JP9.20
PI_GPIO15: JP9.21
PI_GPIO16: JP9.22
PI_GPIO17: JP9.23
PI_GPIO18: JP9.24
PI_GPIO19: JP9.25
PI_GPIO20: JP9.26
PI_GPIO21: JP9.27
PI_GPIO22: JP9.28
PI_GPIO26_ADC0: JP9.29
PI_GPIO27_ADC1: JP9.30
PI_GPIO28_ADC2: JP9.31
NetJ5_1: J5.1 R40.2
NetJ5_2: J5.2 R39.2
NetJ5_3: J5.3 R38.2
NetJ5_4: J5.4 R37.2
NetJ6_1: J6.1 R44.2
NetJ6_2: J6.2 R43.2
NetJ7_1: J7.1 R46.2
NetJ7_2: J7.2 R45.2

### Notes on the sheet
- Project:
- Sheet title:
- BAO BUI Q.
- SAMY VE & VY TRAN
- A3
- Sheet
- Checked by:
- of
- Revision:
- Designed by:
- Size:
- Date:

### Library data of the parts
J5 = Header4: as J3 on sheet DUT; Created Date: 29 March 2013; ComponentLink1URL: http://www.we-online.com; ComponentLink2URL: http://katalog.we-online.de/em/datasheet/6130xx143121.pdf; Created by: Karrer Zheng
J6 J7 = Header2: as J2 on sheet DUT; Created Date: 29 March 2013; ComponentLink1URL: http://www.we-online.com; ComponentLink2URL: http://katalog.we-online.de/em/datasheet/6130xx143121.pdf; Created by: Karrer Zheng
JP8 = JP18x2: WR-PHD 2.54 mm Dual Socket Header; Manufacturer: W¨¹rth Elektronik eiSos GmbH; partNo: 61303621821; ComponentLink1 Description: Manufacturer; ComponentLink2 Description: Datasheet; NoPins: 36; Created Date: 29 March 2013; ComponentLink1URL: http://www.we-online.com; ComponentLink2URL: http://katalog.we-online.de/em/datasheet/6130xx21821.pdf; Created by: Karrer Zheng
JP9 = JP16x2: WR-PHD 2.54 mm Dual Socket Header; Manufacturer: W¨¹rth Elektronik eiSos GmbH; partNo: 61303221821; ComponentLink1 Description: Manufacturer; ComponentLink2 Description: Datasheet; NoPins: 32; Created Date: 29 March 2013; ComponentLink1URL: http://www.we-online.com; ComponentLink2URL: http://katalog.we-online.de/em/datasheet/6130xx21821.pdf; Created by: Karrer Zheng
JP10 = JP20x2: as JP4 on sheet DUT; Created Date: 29 March 2013; ComponentLink1URL: http://www.we-online.com; ComponentLink2URL: http://katalog.we-online.de/em/datasheet/6130xx21821.pdf; Created by: Karrer Zheng
R37-R46 = Res-SMD: as R1 on sheet HIL; Published: 08/06/2000; Publisher: Altium Hobart Technology Centre

## Nets that join several sheets
+3.3 DUT: Power (C25.1 C26.2 R19.1 U5.2), DUT (19 pins)
+3.3 HIL: HIL (28 pins), Power (C21.1 C22.2 R16.1 U4.2), HIL_Header (9 pins)
+5: HIL (D1.2), Power (7 pins), HIL_Header (JP8.16 JP8.21)
GND: HIL (46 pins), Power (16 pins), DUT (31 pins), HIL_Header (11 pins)
CAN_N: HIL (R3.2 U1.6), DUT (R24.2 U6.6)
CAN_P: HIL (R3.1 U1.7), DUT (R24.1 U6.7)
DUT_POWER_STATUS: HIL (U2.46), DUT (U7.47)
HIL_I2C1_SCL: HIL (U2.93), HIL_Header (R41.2 R43.1)
HIL_I2C1_SDA: HIL (U2.92), HIL_Header (R42.2 R44.1)
HIL_PA0: HIL (U2.23), HIL_Header (JP8.33)
HIL_PA1: HIL (U2.24), HIL_Header (JP8.5)
HIL_PA2: HIL (U2.25), HIL_Header (JP8.32)
HIL_PA3: HIL (U2.26), HIL_Header (JP8.6)
HIL_PA4: HIL (U2.29), HIL_Header (JP8.31)
HIL_PA5: HIL (U2.30), HIL_Header (JP8.7)
HIL_PA6: HIL (U2.31), HIL_Header (JP8.30)
HIL_PA7: HIL (U2.32), HIL_Header (JP8.8)
HIL_PA8: HIL (U2.67), HIL_Header (JP8.29)
HIL_PA9: HIL (U2.68), HIL_Header (JP8.9)
HIL_PA10: HIL (U2.69), HIL_Header (JP8.28)
HIL_PB0: HIL (U2.35), HIL_Header (JP10.29)
HIL_PB1: HIL (U2.36), HIL_Header (JP10.12)
HIL_PB3: HIL (U2.89), HIL_Header (JP10.11)
HIL_PB4: HIL (U2.90), HIL_Header (JP10.30)
HIL_PB5: HIL (U2.91), HIL_Header (JP10.10)
HIL_PB10: HIL (U2.47), HIL_Header (JP10.31)
HIL_PB11: HIL (U2.48), HIL_Header (JP10.9)
HIL_PB12: HIL (U2.51), HIL_Header (JP10.32)
HIL_PB13: HIL (U2.52), HIL_Header (JP10.8)
HIL_PB14: HIL (U2.53), HIL_Header (JP10.33)
HIL_PB15: HIL (U2.54), HIL_Header (JP10.7)
HIL_PC0: HIL (U2.15), HIL_Header (JP10.22)
HIL_PC1: HIL (U2.16), HIL_Header (JP10.18)
HIL_PC2: HIL (U2.17), HIL_Header (JP10.23)
HIL_PC3: HIL (U2.18), HIL_Header (JP10.17)
HIL_PC4: HIL (U2.33), HIL_Header (JP10.24)
HIL_PC5: HIL (U2.34), HIL_Header (JP10.16)
HIL_PC6: HIL (U2.63), HIL_Header (JP10.25)
HIL_PC7: HIL (U2.64), HIL_Header (JP10.15)
HIL_PC8: HIL (U2.65), HIL_Header (JP10.26)
HIL_PC9: HIL (U2.66), HIL_Header (JP10.14)
HIL_PC13: HIL (U2.7), HIL_Header (JP10.27)
HIL_PC14: HIL (U2.8), HIL_Header (JP10.13)
HIL_PC15: HIL (U2.9), HIL_Header (JP10.28)
HIL_PD0: HIL (U2.81), HIL_Header (JP10.1)
HIL_PD1: HIL (U2.82), HIL_Header (JP10.40)
HIL_PD2: HIL (U2.83), HIL_Header (JP10.2)
HIL_PD3: HIL (U2.84), HIL_Header (JP10.39)
HIL_PD7: HIL (U2.88), HIL_Header (JP10.38)
HIL_PD8: HIL (U2.55), HIL_Header (JP10.34)
HIL_PD9: HIL (U2.56), HIL_Header (JP10.6)
HIL_PD10: HIL (U2.57), HIL_Header (JP10.35)
HIL_PD11: HIL (U2.58), HIL_Header (JP10.5)
HIL_PD12: HIL (U2.59), HIL_Header (JP10.36)
HIL_PD13: HIL (U2.60), HIL_Header (JP10.4)
HIL_PD14: HIL (U2.61), HIL_Header (JP10.37)
HIL_PD15: HIL (U2.62), HIL_Header (JP10.3)
HIL_PE0: HIL (U2.97), HIL_Header (JP8.36)
HIL_PE1: HIL (U2.98), HIL_Header (JP8.1)
HIL_PE2: HIL (U2.1), HIL_Header (JP8.2)
HIL_PE3: HIL (U2.2), HIL_Header (JP8.35)
HIL_PE4: HIL (U2.3), HIL_Header (JP8.3)
HIL_PE5: HIL (U2.4), HIL_Header (JP8.34)
HIL_PE6: HIL (U2.5), HIL_Header (JP8.4)
HIL_PE7: HIL (U2.38), HIL_Header (JP8.10)
HIL_PE8: HIL (U2.39), HIL_Header (JP8.27)
HIL_PE9: HIL (U2.40), HIL_Header (JP8.11)
HIL_PE10: HIL (U2.41), HIL_Header (JP8.26)
HIL_PE11: HIL (U2.42), HIL_Header (JP8.12)
HIL_PE12: HIL (U2.43), HIL_Header (JP8.25)
HIL_PE13: HIL (U2.44), HIL_Header (JP8.24)
HIL_SPI3_CS: HIL (U2.77), HIL_Header (R40.1)
HIL_SPI3_MISO: HIL (U2.79), HIL_Header (R38.1)
HIL_SPI3_MOSI: HIL (U2.80), HIL_Header (R37.1)
HIL_SPI3_SCK: HIL (U2.78), HIL_Header (R39.1)
HIL_USART2_RX: HIL (U2.87), HIL_Header (R45.1)
HIL_USART2_TX: HIL (U2.86), HIL_Header (R46.1)
PI_GPIO0: HIL (U3.1), HIL_Header (JP9.2)
PI_GPIO1: HIL (U3.2), HIL_Header (JP9.3)
PI_GPIO2: HIL (U3.4), HIL_Header (JP9.4)
PI_GPIO3: HIL (U3.5), HIL_Header (JP9.5)
PI_GPIO4: HIL (U3.6), HIL_Header (JP9.6)
PI_GPIO5: HIL (U3.7), HIL_Header (JP9.7)
PI_GPIO6: HIL (U3.9), HIL_Header (JP9.8)
PI_GPIO7: HIL (U3.10), HIL_Header (JP9.9)
PI_GPIO8: HIL (U3.11), HIL_Header (JP9.10)
PI_GPIO9: HIL (U3.12), HIL_Header (JP9.11)
PI_GPIO10: HIL (U3.14), HIL_Header (JP9.12)
PI_GPIO11: HIL (U3.15), HIL_Header (JP9.13)
PI_GPIO12: HIL (U3.16), HIL_Header (JP9.14)
PI_GPIO13: HIL (U3.17), HIL_Header (JP9.19)
PI_GPIO14: HIL (U3.19), HIL_Header (JP9.20)
PI_GPIO15: HIL (U3.20), HIL_Header (JP9.21)
PI_GPIO16: HIL (U3.21), HIL_Header (JP9.22)
PI_GPIO17: HIL (U3.22), HIL_Header (JP9.23)
PI_GPIO18: HIL (U3.24), HIL_Header (JP9.24)
PI_GPIO19: HIL (U3.25), HIL_Header (JP9.25)
PI_GPIO20: HIL (U3.26), HIL_Header (JP9.26)
PI_GPIO21: HIL (U3.27), HIL_Header (JP9.27)
PI_GPIO22: HIL (U3.29), HIL_Header (JP9.28)
PI_GPIO26_ADC0: HIL (U3.31), HIL_Header (JP9.29)
PI_GPIO27_ADC1: HIL (U3.32), HIL_Header (JP9.30)
PI_GPIO28_ADC2: HIL (U3.34), HIL_Header (JP9.31)
Power_on: HIL (U2.45), Power (R21.2)